# EAGLE schematic hayaoshi (EAGLE 9.0.0)
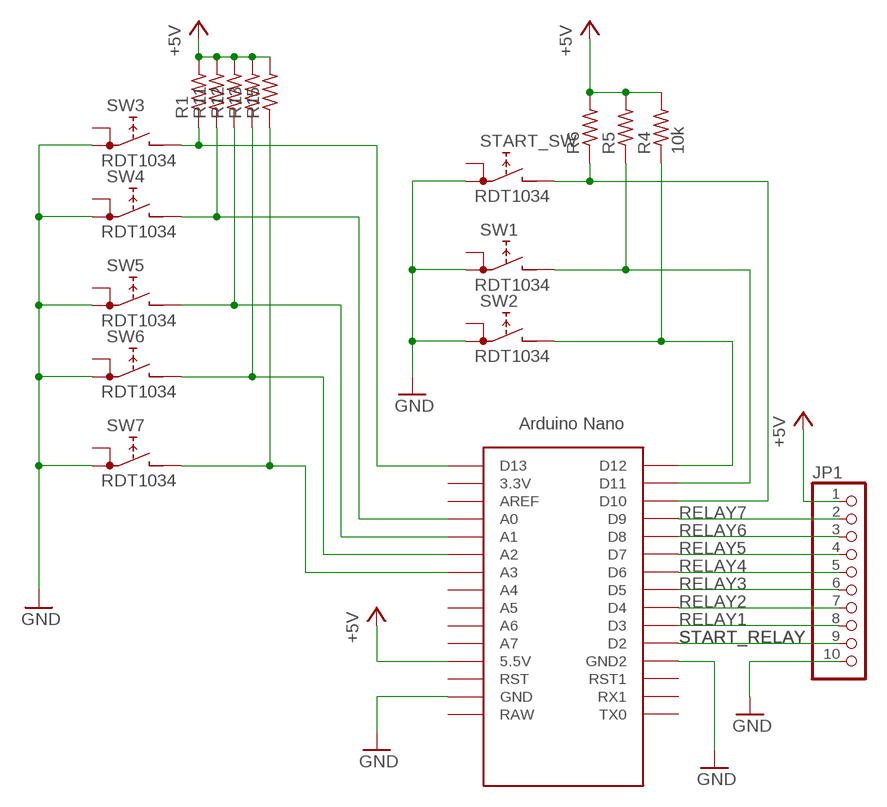
[diagram p0: schematic, sheet 1]

## Parts
JP1  PINHD-1X10  [1X10]
R1  R-US_0207/10  [0207/10]
R4  10k  R-US_0207/10  [0207/10]
R5  R-US_0207/10  [0207/10]
R6  R-US_0207/10  [0207/10]
R11  R-US_0207/10  [0207/10]
R12  R-US_0207/10  [0207/10]
R13  R-US_0207/10  [0207/10]
R15  R-US_0207/10  [0207/10]
START_SW  RDT1034  [RDT1034]
SW1  RDT1034  [RDT1034]
SW2  RDT1034  [RDT1034]
SW3  RDT1034  [RDT1034]
SW4  RDT1034  [RDT1034]
SW5  RDT1034  [RDT1034]
SW6  RDT1034  [RDT1034]
SW7  RDT1034  [RDT1034]
U$1  NANO  [NANO]

## Nets
+5V: JP1.1 R1.2 R4.2 R5.2 R6.2 R11.2 R12.2 R13.2 R15.2 U$1.5V(5.5V)
GND: JP1.10 START_SW.A1 SW1.A1 SW2.A1 SW3.A1 SW4.A1 SW5.A1 SW6.A1 SW7.A1 U$1.GND U$1.GND1(GND2)
N$1: R6.1 START_SW.B U$1.D10
N$2: R5.1 SW1.B U$1.D11
N$3: R4.1 SW2.B U$1.D12
N$10: R15.1 SW7.B U$1.A3
N$11: R13.1 SW6.B U$1.A2
N$12: R12.1 SW5.B U$1.A1
N$13: R11.1 SW4.B U$1.A0
N$14: R1.1 SW3.B U$1.D13
RELAY1: JP1.8 U$1.D3
RELAY2: JP1.7 U$1.D4
RELAY3: JP1.6 U$1.D5
RELAY4: JP1.5 U$1.D6
RELAY5: JP1.4 U$1.D7
RELAY6: JP1.3 U$1.D8
RELAY7: JP1.2 U$1.D9
START_RELAY: JP1.9 U$1.D2
Unconnected: START_SW.A SW1.A SW2.A SW3.A SW4.A SW5.A SW6.A SW7.A U$1.3.3V U$1.A4 U$1.A5 U$1.A6 U$1.A7 U$1.AREF U$1.ICSP1 U$1.ICSP2 U$1.ICSP3 U$1.ICSP4 U$1.ICSP5 U$1.ICSP6 U$1.RAW U$1.RST U$1.RST1 U$1.RX1 U$1.TX0

## Library data of the parts
JP1 = pinhead:PINHD-1X10: PIN HEADER
R1 R4-R6 R11-R13 R15 = rcl:R-US_: RESISTOR, American symbol; SPICEPREFIX: R
START_SW SW1-SW7 = switch:RDT1034: PUSH SWITCH www.radiohm.com
U$1 = Arduino-clone:NANO: Arduino Nano